# Altium schematic sheet Ethernet Module.SchDoc
size A4; SheetNumber: 5; SheetTotal: 5
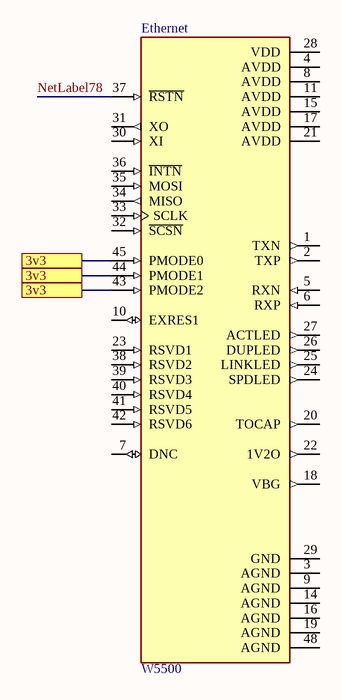
[diagram p0: Ethernet Module.SchDoc]

## Parts
Ethernet  W5500  [QFP50P900X900X160-48N]

## Ports
3v3 (see Ethernet Module[2B])

## Nets
3v3: Ethernet.43(PMODE2) Ethernet.44(PMODE1) Ethernet.45(PMODE0) ; port 3v3
NetLabel78: Ethernet.37(~{RSTN})

Not connected (* = marked no-connect by the designer): Ethernet 1(TXN) 2(TXP) 3(AGND) 4(AVDD) 5(RXN) 6(RXP) 7(DNC) 8(AVDD) 9(AGND) 10(EXRES1) 11(AVDD) 14(AGND) 15(AVDD) 16(AGND) 17(AVDD) 18(VBG) 19(AGND) 20(TOCAP) 21(AVDD) 22(1V2O) 23(RSVD1) 24(SPDLED) 25(LINKLED) 26(DUPLED) 27(ACTLED) 28(VDD) 29(GND) 30(XI) 31(XO) 32(~{SCSN}) 33(SCLK) 34(MISO) 35(MOSI) 36(~{INTN}) 38(RSVD2) 39(RSVD3) 40(RSVD4) 41(RSVD5) 42(RSVD6) 48(AGND)

## Library data of the parts
Ethernet = W5500: Ethernet Controller 10/100 Base-T/TX PHY SPI Interface 48-LQFP (7x7); MF: WIZnet; Value: *; Package: None; Check_prices: https://www.snapeda.com/parts/W5500/WIZnet/view-part/?ref=eda; Price: None; MP: W5500; Availability: In Stock; SnapEDA_Link: https://www.snapeda.com/parts/W5500/WIZnet/view-part/?ref=snap; Purchase-URL: https://pricing.snapeda.com/search/part/W5500/?ref=eda